# EAGLE schematic Steckkarte (EAGLE 9.3.1)
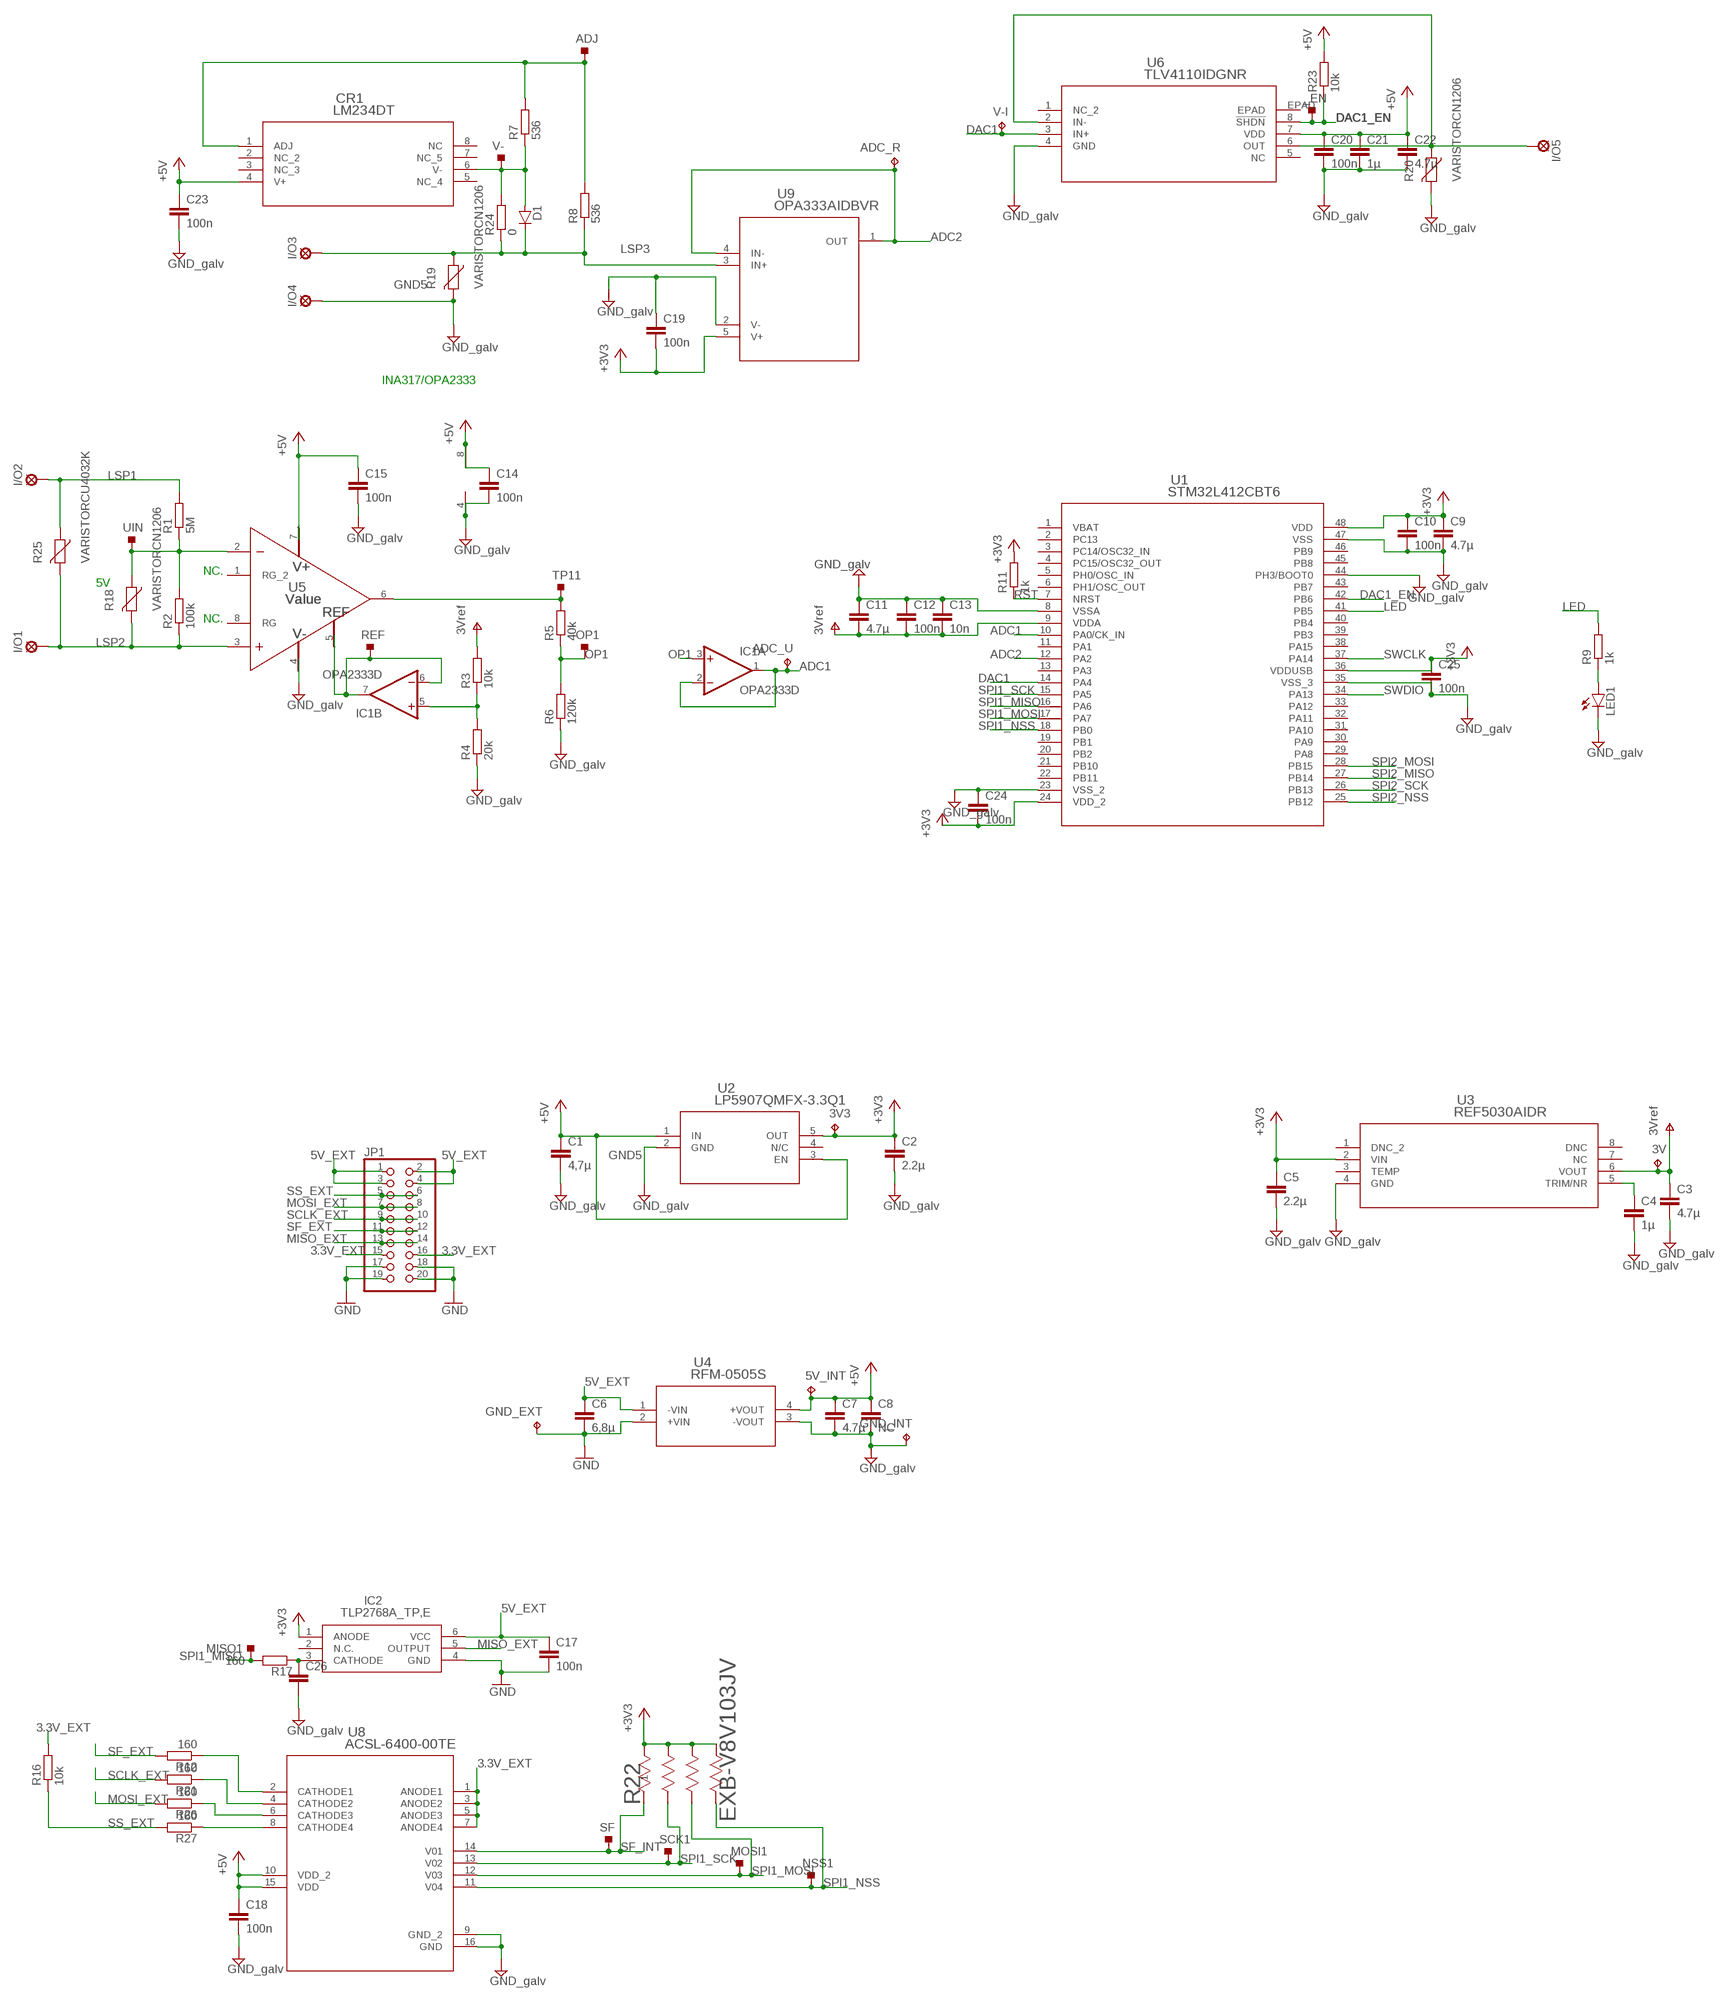
[diagram p0: schematic, sheet 1, part 1 of 2]
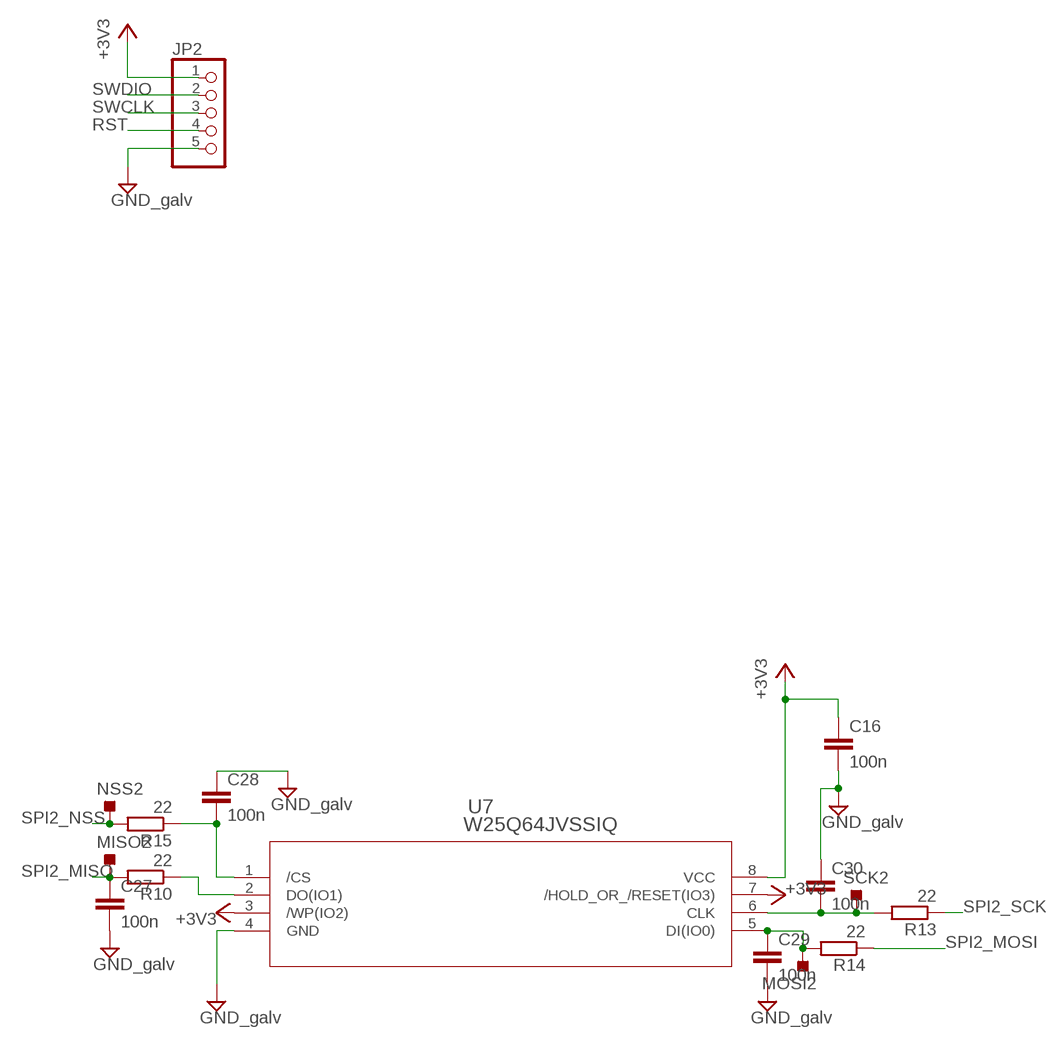
[diagram p1: schematic, sheet 1, part 2 of 2]

## Parts
3V  TPPAD1-13  [P1-13]
3V3  TPPAD1-13  [P1-13]
5V_INT  TPPAD1-13  [P1-13]
_EN  TESTPOINT_TPS-SMD-10SN  [TESTPOINT_SMD-10SN]
ADC_R  TPPAD1-13  [P1-13]
ADC_U  TPPAD1-13  [P1-13]
ADJ  TESTPOINT_TPS-SMD-10SN  [TESTPOINT_SMD-10SN]
C1  4,7µ  C-EUC0603K  [C0603K]
C2  2.2µ  C-EUC0603K  [C0603K]
C3  4.7µ  C-EUC0603K  [C0603K]
C4  1µ  C-EUC0603K  [C0603K]
C5  2.2µ  C-EUC0603K  [C0603K]
C6  6,8µ  C-EUC0603K  [C0603K]
C7  4.7µ  C-EUC0603K  [C0603K]
C8  NC  C-EUC0603K  [C0603K]
C9  4.7µ  C-EUC0603K  [C0603K]
C10  100n  C-EUC0603K  [C0603K]
C11  4.7µ  C-EUC0603K  [C0603K]
C12  100n  C-EUC0603K  [C0603K]
C13  10n  C-EUC0603K  [C0603K]
C14  100n  C-EUC0603K  [C0603K]
C15  100n  C-EUC0603K  [C0603K]
C16  100n  C-EUC0603K  [C0603K]
C17  100n  C-EUC0603K  [C0603K]
C18  100n  C-EUC0603K  [C0603K]
C19  100n  C-EUC0603K  [C0603K]
C20  100n  C-EUC0603K  [C0603K]
C21  1µ  C-EUC0603K  [C0603K]
C22  4.7µ  C-EUC0603K  [C0603K]
C23  100n  C-EUC0603K  [C0603K]
C24  100n  C-EUC0603K  [C0603K]
C25  100n  C-EUC0603K  [C0603K]
C26  C-EUC0603K  [C0603K]
C27  100n  C-EUC0603K  [C0603K]
C28  100n  C-EUC0603K  [C0603K]
C29  100n  C-EUC0603K  [C0603K]
C30  100n  C-EUC0603K  [C0603K]
CR1  LM234DT  [SO-8]
D1  D-SOD123  [SOD123]
GND_EXT  TPPAD1-13  [P1-13]
GND_INT  TPPAD1-13  [P1-13]
I/O1  SE14  [SE14]
I/O2  SE14  [SE14]
I/O3  SE14  [SE14]
I/O4  SE14  [SE14]
I/O5  SE14  [SE14]
IC1  OPA2333D  [SO08]
IC2  TLP2768A_TP,E  [SOIC127P1000X220-6N]
JP1  PINHD-2X10/90  [2X10/90]
JP2  PINHD-1X5  [1X05]
LED1  LED5MM  [LED5MM]
MISO1  TESTPOINT_TPS-SMD-10SN  [TESTPOINT_SMD-10SN]
MISO2  TESTPOINT_TPS-SMD-10SN  [TESTPOINT_SMD-10SN]
MOSI1  TESTPOINT_TPS-SMD-10SN  [TESTPOINT_SMD-10SN]
MOSI2  TESTPOINT_TPS-SMD-10SN  [TESTPOINT_SMD-10SN]
NSS1  TESTPOINT_TPS-SMD-10SN  [TESTPOINT_SMD-10SN]
NSS2  TESTPOINT_TPS-SMD-10SN  [TESTPOINT_SMD-10SN]
OP1  TESTPOINT_TPS-SMD-10SN  [TESTPOINT_SMD-10SN]
R1  5M  R-EU_R1206  [R1206]
R2  100k  R-EU_R1206  [R1206]
R3  10k  R-EU_R0603  [R0603]
R4  20k  R-EU_R0603  [R0603]
R5  40k  R-EU_R0603  [R0603]
R6  120k  R-EU_R0603  [R0603]
R7  536  R-EU_R0603  [R0603]
R8  536  R-EU_R0603  [R0603]
R9  1k  R-EU_R0603  [R0603]
R10  22  R-EU_R0603  [R0603]
R11  1k  R-EU_R0603  [R0603]
R12  160  R-EU_R0603  [R0603]
R13  22  R-EU_R0603  [R0603]
R14  22  R-EU_R0603  [R0603]
R15  22  R-EU_R0603  [R0603]
R16  10k  R-EU_R0603  [R0603]
R17  160  R-EU_R0603  [R0603]
R18  VARISTORCN1206  [CT/CN1206]
R19  VARISTORCN1206  [CT/CN1206]
R20  VARISTORCN1206  [CT/CN1206]
R21  160  R-EU_R0603  [R0603]
R22  EXB-V8V103JV  [EXBV8V]
R23  10k  R-EU_R0603  [R0603]
R24  0  R-EU_R0603  [R0603]
R25  VARISTORCU4032K  [CU4032K]
R26  160  R-EU_R0603  [R0603]
R27  160  R-EU_R0603  [R0603]
REF  TESTPOINT_TPS-SMD-10SN  [TESTPOINT_SMD-10SN]
SCK1  TESTPOINT_TPS-SMD-10SN  [TESTPOINT_SMD-10SN]
SCK2  TESTPOINT_TPS-SMD-10SN  [TESTPOINT_SMD-10SN]
SF  TESTPOINT_TPS-SMD-10SN  [TESTPOINT_SMD-10SN]
TP11  TESTPOINT_TPS-SMD-10SN  [TESTPOINT_SMD-10SN]
U1  STM32L412CBT6  [LQFP-48]
U2  LP5907QMFX-3.3Q1  [DBV5]
U3  REF5030AIDR  [D8]
U4  RFM-0505S  [RFM-0505S]
U5  Value  INA317IDGKR  [DGK0008A_N]
U6  TLV4110IDGNR  [DGN8_1P89X1P57]
U7  W25Q64JVSSIQ  [SOIC-8_5P28X5P28]
U8  ACSL-6400-00TE  [SOIC_6400-00TE]
U9  OPA333AIDBVR  [DBV5]
UIN  TESTPOINT_TPS-SMD-10SN  [TESTPOINT_SMD-10SN]
V-  TESTPOINT_TPS-SMD-10SN  [TESTPOINT_SMD-10SN]
V-I  TPPAD1-13  [P1-13]

## Nets
3.3V_EXT: JP1.15 JP1.16 R16.2 U8.1(ANODE1) U8.3(ANODE2) U8.5(ANODE3) U8.7(ANODE4)
5V_EXT: C6.1 C17.1 IC2.6(VCC) JP1.1 JP1.2 JP1.3 JP1.4 U4.1(-VIN)
+3V3: 3V3.TP C2.1 C5.1 C9.1 C10.1 C16.1 C19.2 C24.2 C25.1 IC2.1(ANODE) JP2.1 R11.2 R22.5 R22.6 R22.7 R22.8 U1.24(VDD_2) U1.36(VDDUSB) U1.48(VDD) U2.5(OUT) U3.2(VIN) U7.3(/WP(IO2)) U7.7(/HOLD_OR_/RESET(IO3)) U7.8(VCC) U9.5(V+)
+5V: 5V_INT.TP C1.1 C7.1 C8.1 C14.1 C15.1 C18.1 C20.1 C21.1 C22.1 C23.1 CR1.4(V+) IC1.8(P:V+) R23.2 U2.1(IN) U2.3(EN) U4.4(+VOUT) U5.7(V+) U6.7(VDD) U8.10(VDD_2) U8.15(VDD)
ADC1: ADC_U.TP IC1.1(A:OUT) IC1.2(A:-IN) U1.10(PA0/CK_IN)
ADC2: ADC_R.TP U1.12(PA2) U9.1(OUT) U9.4(IN-)
DAC1: U1.14(PA4) U6.3(IN+) V-I.TP
DAC1_EN: _EN.TP R23.1 U1.42(PB6) U6.8(!SHDN)
GND: C6.2 C17.2 GND_EXT.TP IC2.4(GND) JP1.17 JP1.18 JP1.19 JP1.20 U4.2(+VIN)
GND5: C1.2 C2.2 C3.2 C4.2 C5.2 C7.2 C8.2 C9.2 C10.2 C11.1 C12.1 C13.1 C14.2 C15.2 C16.2 C18.2 C19.1 C20.2 C21.2 C22.2 C23.2 C24.1 C25.2 C26.2 C27.2 C28.1 C29.2 C30.1 GND_INT.TP I/O4.MP IC1.4(P:V-) JP2.5 LED1.K(C) R4.1 R6.1 R19.2 R20.2 U1.8(VSSA) U1.23(VSS_2) U1.35(VSS_3) U1.44(PH3/BOOT0) U1.47(VSS) U2.2(GND) U3.4(GND) U4.3(-VOUT) U5.4(V-) U6.4(GND) U7.4(GND) U8.9(GND_2) U8.16(GND) U9.2(V-) ; supply symbol labelled GND_galv
LED: R9.2 U1.41(PB5)
LSP1: I/O2.MP R1.2 R25.1
LSP2: I/O1.MP R2.1 R18.2 R25.2 U5.3(IN+)
LSP3: D1.1(C) I/O3.MP R8.1 R19.1 R24.1 U9.3(IN+)
LSP5: I/O5.MP R20.1 U6.2(IN-) U6.6(OUT)
MISO_EXT: IC2.5(OUTPUT) JP1.13 JP1.14
MOSI_EXT: JP1.7 JP1.8 R26.2
N$1: LED1.A R9.1
N$2: R1.1 R2.2 R18.1 U5.2(IN-) UIN.TP
N$3: R10.1 U7.2(DO(IO1))
N$4: R5.2 TP11.TP U5.6(OUT)
N$6: IC1.5(B:+IN) R3.1 R4.2
N$7: C4.1 U3.5(TRIM/NR)
N$8: IC1.6(B:-IN) IC1.7(B:OUT) REF.TP U5.5(REF)
N$9: R27.1 U8.8(CATHODE4)
N$11: CR1.6(V-) D1.2(A) R7.1 R24.2 V-.TP
N$12: ADJ.TP CR1.1(ADJ) R7.2 R8.2
N$13: C30.2 R13.2 SCK2.TP U7.6(CLK)
N$14: C29.1 MOSI2.TP R14.2 U7.5(DI(IO0))
N$15: C28.2 R15.1 U7.1(/CS)
N$16: R26.1 U8.6(CATHODE3)
N$17: R21.1 U8.4(CATHODE2)
N$18: R12.1 U8.2(CATHODE1)
N$19: C26.1 IC2.3(CATHODE) R17.1
OP1: IC1.3(A:+IN) OP1.TP R5.1 R6.2
RST: JP2.4 R11.1 U1.7(NRST)
SCLK_EXT: JP1.9 JP1.10 R21.2
SF_EXT: JP1.11 JP1.12 R12.2
SF_INT: R22.1 SF.TP U8.14(V01)
SPI1_MISO: MISO1.TP R17.2 U1.16(PA6)
SPI1_MOSI: MOSI1.TP R22.3 U1.17(PA7) U8.12(V03)
SPI1_NSS: NSS1.TP R22.4 U1.18(PB0) U8.11(V04)
SPI1_SCK: R22.2 SCK1.TP U1.15(PA5) U8.13(V02)
SPI2_MISO: C27.1 MISO2.TP R10.2 U1.27(PB14)
SPI2_MOSI: R14.1 U1.28(PB15)
SPI2_NSS: NSS2.TP R15.2 U1.25(PB12)
SPI2_SCK: R13.1 U1.26(PB13)
SS_EXT: JP1.5 JP1.6 R16.1 R27.2
SWCLK: JP2.3 U1.37(PA14)
SWDIO: JP2.2 U1.34(PA13)
V+: 3V.TP C3.1 C11.2 C12.2 C13.2 R3.2 U1.9(VDDA) U3.6(VOUT) ; supply symbol labelled 3Vref
Unconnected: CR1.2(NC_2) CR1.3(NC_3) CR1.5(NC_4) CR1.7(NC_5) CR1.8(NC) IC2.2(N.C.) U1.2(PC13) U1.3(PC14/OSC32_IN) U1.4(PC15/OSC32_OUT) U1.5(PH0/OSC_IN) U1.6(PH1/OSC_OUT) U1.11(PA1) U1.13(PA3) U1.19(PB1) U1.20(PB2) U1.21(PB10) U1.22(PB11) U1.29(PA8) U1.30(PA9) U1.31(PA10) U1.32(PA11) U1.33(PA12) U1.38(PA15) U1.39(PB3) U1.40(PB4) U1.43(PB7) U1.45(PB8) U1.46(PB9) U2.4(N/C) U3.1(DNC_2) U3.3(TEMP) U3.7(NC) U3.8(DNC) U5.1(RG_2) U5.8(RG) U6.1(NC_2) U6.5(NC) U6.EPAD

## Notes on the sheet
- INA317/OPA2333
- NC.
- 5V
- NC.

## Power pins joined to a net without a drawn wire
VBAT: U1.1(VBAT)

## Library data of the parts
3V 3V3 5V_INT ADC_R ADC_U GND_EXT GND_INT V-I = testpad:TP: Test pad
_EN ADJ MISO1 MISO2 MOSI1 MOSI2 NSS1 NSS2 OP1 REF SCK1 SCK2 SF TP11 UIN V- = 52101-101-REV-A:TESTPOINT_TPS: TEST POINT PAD; BOM: EXCLUDE
C1-C5 C9-C30 = rcl:C-EU: CAPACITOR, European symbol; SPICEPREFIX: C
C6-C8 = resistor:C-EU: CAPACITOR, European symbol
CR1 = LM234:LM234DT; BUILT_BY: EMA_UL_Team; MANUFACTURER_PART_NUMBER: LM234DT; VENDOR: STMicroelectronics
D1 = semicon-smd-ipc:D-: DIODE unfilled
I/O1-I/O5 = solpad:SE14: SOLDER PAD E1553, drill 1,4mm, distributor Buerklin, 07F820
IC1 = linear:OPA2333: DUAL 1.8V, microPOWER CMOS OPERATIONAL AMPLIFIERS Zerø-Drift Series Source: Texas Instruments (Burr-Brown) .. U11 opa333 Operational Amp.pdf
IC2 = SamacSys_Parts:TLP2768A_TP,E: High Speed Optocouplers High-Speed (20 Mbps) IC Photocoupler Source: Datasheet <https://componentsearchengine.com/Datasheets/1/TLP2768A(TP,E.pdf>; DESCRIPTION: High Speed Optocouplers High-Speed (20 Mbps) IC Photocoupler; HEIGHT: 2.2mm; MANUFACTURER_NAME: Toshiba; MANUFACTURER_PART_NUMBER: TLP2768A(TP,E; MOUSER_PART_NUMBER: 757-TLP2768ATPE; MOUSER_PRICE-STOCK: https://www.mouser.com/Search/Refine.aspx?Keyword=757-TLP2768ATPE
JP1 = pinhead:PINHD-2X10: PIN HEADER
JP2 = pinhead:PINHD-1X5: PIN HEADER
LED1 = led:LED: LED OSRAM: - CHIPLED LG R971, LG N971, LY N971, LG Q971, LY Q971, LO R971, LY R971 LH N974, LH R974 LS Q976, LO Q976, LY Q976 LO Q996 - Hyper CHIPLED LW Q18S LB Q993, LB Q99A, LB R99A - SideLED LS A670, LO A670, LY A670, LG A670, LP A670 LB A673, LV A673, LT A673, LW A673 LH A674 LY A675 LS A676, LA A676, LO A676, LY A676, LW A676 LS A679, LY A679, LG A679 - Hyper Micro SIDELED® LS Y876, LA Y876, LO Y876, LY Y876 LT Y87S - SmartLED LW L88C, LW L88S LB L89C, LB L89S, LG L890 LS L89K, LO L89K, LY L89K LS L896, LA L896, LO L896, LY L896 - TOPLED LS T670, LO T670, LY T670, LG T670, LP T670 LSG T670, LSP T670, LSY T670, LOP T670, LYG T670 LG T671, LOG T671, LSG T671 LB T673, LV T673, LT T673, LW T673 LH T674 LS T676, LA T676, LO T676, LY T676, LB T676, LH T676, LSB T676, LW T676 LB T67C, LV T67C, LT T67C, LS T67K, LO T67K, LY T67K, LW E67C LS E67B, LA E67B, LO E67B, LY E67B, LB E67C, LV E67C, LT E67C LW T67C LS T679, LY T679, LG T679 LS T770, LO T770, LY T770, LG T770, LP T770 LB T773, LV T773, LT T773, LW T773 LH T774 LS E675, LA E675, LY E675, LS T675 LS T776, LA T776, LO T776, LY T776, LB T776 LHGB T686 LT T68C, LB T68C - Hyper Mini TOPLED® LB M676 - Mini TOPLED Santana® LG M470 LS M47K, LO M47K, LY M47K Source: http://www.osram.convergy.de LUXEON: - LUMILED® LXK2-PW12-R00, LXK2-PW12-S00, LXK2-PW14-U00, LXK2-PW14-V00 LXK2-PM12-R00, LXK2-PM12-S00, LXK2-PM14-U00 LXK2-PE12-Q00, LXK2-PE12-R00, LXK2-PE12-S00, LXK2-PE14-T00, LXK2-PE14-U00 LXK2-PB12-K00, LXK2-PB12-L00, LXK2-PB12-M00, LXK2-PB14-N00, LXK2-PB14-P00, LXK2-PB14-Q00 LXK2-PR12-L00, LXK2-PR12-M00, LXK2-PR14-Q00, LXK2-PR14-R00 LXK2-PD12-Q00, LXK2-PD12-R00, LXK2-PD12-S00 LXK2-PH12-R00, LXK2-PH12-S00 LXK2-PL12-P00, LXK2-PL12-Q00, LXK2-PL12-R00 Source: www.luxeon.com KINGBRIGHT: KA-3528ASYC Source: www.kingbright.com
R1-R17 R21 R23 R24 R26 R27 = rcl:R-EU_: RESISTOR, European symbol; SPICEPREFIX: R
R18-R20 R25 = varistor:VARISTOR: VARISTOR
R22 = EXB-V8V103:EXB-V8V103JV; BUILT_BY: EMA_UL_Team; MANUFACTURER_PART_NUMBER: EXB-V8V103JV; VENDOR: Panasonic
U1 = stm32l412CB6T:STM32L412CBT6; BUILT_BY: EMA_Jessica; COPYRIGHT: Copyright (C) 2018 Accelerated Designs. All rights reserved; MANUFACTURER_PART_NUMBER: STM32L412CBT6; VENDOR: STMicroelectronics
U2 = LP5907:LP5907QMFX-3.3Q1; BUILT_BY: EMA_UL_Team; MANUFACTURER_PART_NUMBER: LP5907QMFX-3.3Q1; VENDOR: Texas Instruments
U3 = REF5030:REF5030AIDR; BUILT_BY: EMA_UL_Team; MANUFACTURER_PART_NUMBER: REF5030AIDR; VENDOR: Texas Instruments
U4 = RFM0505S:RFM-0505S; BUILT_BY: EMA_Cory; COPYRIGHT: Copyright (C) 2018 Accelerated Designs. All rights reserved; MANUFACTURER_PART_NUMBER: RFM-0505S; VENDOR: Recom Power
U5 = ina317:INA317IDGKR; MANUFACTURER: Texas Instruments; PARTNUMBER: INA317IDGKR; REFDES: RefDes; TYPE: TYPE
U6 = TLV4110:TLV4110IDGNR; DATASHEET_URL: http://www.ti.com/lit/gpn/TLV4110; DESCRIPTION: High Output Drive, Low Voltage, Single Operational Amplifier w/Shutdown; FAMILY_NAME: HIGH OUTPUT CURRENT; GENERIC_PART_NUMBER: TLV4110; INDUSTRY_STD_PKG_TYPE: MSOP-PowerPAD; MANUFACTURER: Texas Instruments; MANUFACTURER_PART_NUMBER: TLV4110IDGNR; PACKAGE_DESIGNATOR: DGN; PIN_COUNT: 8; VENDOR: Texas Instruments
U7 = W25Q64JVSSIQ:W25Q64JVSSIQ; BUILT_BY: EMA_Anthony; COPYRIGHT: Copyright (C) 2018 Accelerated Designs. All rights reserved; MANUFACTURER_PART_NUMBER: W25Q64JVSSIQ; VENDOR: Winbond
U8 = ACSL-6400:ACSL-6400-00TE; BUILT_BY: EMA_Matt; COPYRIGHT: Copyright (C) 2018 Accelerated Designs. All rights reserved; MANUFACTURER_PART_NUMBER: ACSL-6400-00TE; VENDOR: Broadcom
U9 = OPA2333ADBV:OPA333AIDBVR; DATASHEET_URL: http://www.ti.com/lit/gpn/OPA333; DESCRIPTION: 1.8V, 17µA, microPower, Precision, Zero Drift CMOS Op Amp; FAMILY_NAME: LOW OFFSET VOLTAGE; GENERIC_PART_NUMBER: OPA333; INDUSTRY_STD_PKG_TYPE: SOT-23; MANUFACTURER: Texas Instruments; MANUFACTURER_PART_NUMBER: OPA333AIDBVR; PACKAGE_DESIGNATOR: DBV; PIN_COUNT: 5; VENDOR: Texas Instruments